# EAGLE design Function-Button-Board (EAGLE 7.1.0)
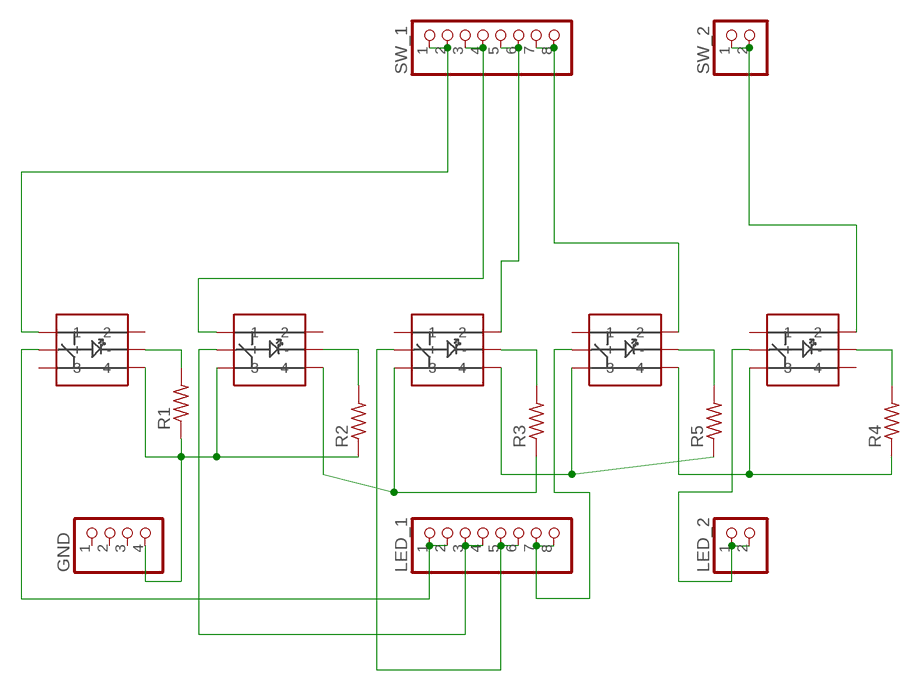
[diagram p0: schematic, sheet 1]

## Parts
FN_1  PB614  [PB614]
FN_2  PB614  [PB614]
FN_3  PB614  [PB614]
FN_4  PB614  [PB614]
FN_5  PB614  [PB614]
GND  PINHD-1X4  [1X04]
LED_1  PINHD-1X8  [1X08]
LED_2  PINHD-1X2  [1X02]
R1  R-US_R1206  [R1206]
R2  R-US_R1206  [R1206]
R3  R-US_R1206  [R1206]
R4  R-US_R1206  [R1206]
R5  R-US_R1206  [R1206]
SW_1  PINHD-1X8  [1X08]
SW_2  PINHD-1X2  [1X02]

## Nets
N$1: FN_1.L+(+) LED_1.1 LED_1.2
N$2: FN_1.L-(-) R1.2
N$3: FN_1.1 SW_1.1 SW_1.2
N$4: FN_3.L+(+) LED_1.5 LED_1.6
N$5: FN_1.4 FN_2.3 GND.4 R1.1 R2.1
N$6: FN_4.L+(+) LED_1.7 LED_1.8
N$7: FN_2.1 SW_1.3 SW_1.4
N$8: FN_2.L+(+) LED_1.3 LED_1.4
N$9: FN_5.L+(+) LED_2.1 LED_2.2
N$10: FN_2.L-(-) R2.2
N$11: FN_3.L-(-) R3.2
N$12: FN_2.4 FN_3.3 R3.1
N$14: FN_4.L-(-) R5.2
N$15: FN_5.L-(-) R4.2
N$16: FN_3.2 SW_1.5 SW_1.6
N$17: FN_3.4 FN_4.3 R5.1
N$18: FN_5.2 SW_2.1 SW_2.2
N$19: FN_4.2 SW_1.7 SW_1.8
N$20: FN_4.4 FN_5.3 R4.1
Unconnected: FN_1.2 FN_1.3 FN_2.2 FN_3.1 FN_4.1 FN_5.1 FN_5.4 GND.1 GND.2 GND.3

## Library data of the parts
FN_1-FN_5 = RSJ-PB614:PB614
GND = pinhead:PINHD-1X4: PIN HEADER
LED_1 SW_1 = pinhead:PINHD-1X8: PIN HEADER
LED_2 SW_2 = pinhead:PINHD-1X2: PIN HEADER
R1-R5 = resistor:R-US_: RESISTOR, American symbol

## Board
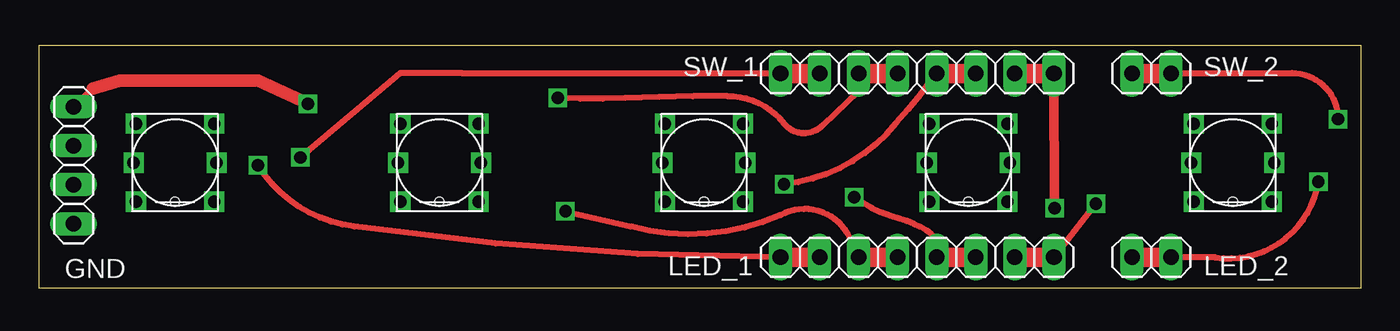
[diagram p1: board, top side]
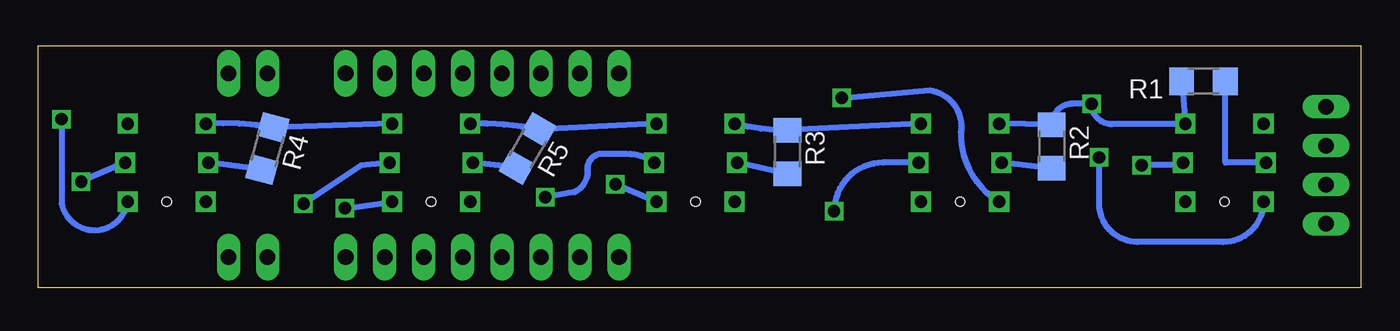
[diagram p2: board, bottom side, seen from below]

Size 86 x 15.77 mm. Coordinates in mm from the lower left corner, seen from the top.
Outline: 0,0 86,0 86,15.77 0,15.77 0,0
Copper layers (1*16): Top 0.035mm / dielectric 1.5mm / Bottom 0.035mm
Design rules "ITEADstudio_DRC": minimum track width 6mil, minimum drill 12mil, track to track 6mil, track to pad 6mil, pad to pad 6mil, via to via 6mil, smd to smd 0mil, copper to edge 10mil, drill to drill 10mil, minimum pad ring 10mil, minimum via ring 6mil, stop-mask expansion 2mil, vias tented up to drill 100mil, thermal gap 10mil

### Footprints (pad centres in the part's own frame; a part is rotated, then mirrored left to right if it is on the bottom)
PB614 = drill 0.8 square: 1 -2.54,2.54; 2 -2.54,-2.54; 3 2.54,2.54; 4 2.54,-2.54; L+ 0,-2.7; L- 0,2.7 | hole 0.6: -2.54,0
1X04 = drill 1.016 long: 1 -3.81,0; 2 -1.27,0; 3 1.27,0; 4 3.81,0
1X08 = drill 1.016 long: 1 -8.89,0; 2 -6.35,0; 3 -3.81,0; 4 -1.27,0; 5 1.27,0; 6 3.81,0; 7 6.35,0; 8 8.89,0
1X02 = drill 1.016 long: 1 -1.27,0; 2 1.27,0
R1206 = smd 1.6 x 1.803: 1 -1.422,0; 2 1.422,0

### Placement (x,y rotation side)
FN_1  8.85,8.16 90 top
FN_2  26.05,8.16 90 top
FN_3  43.25,8.16 90 top
FN_4  60.45,8.16 90 top
FN_5  77.65,8.16 90 top
GND  2.25,8 90 top
LED_1  57.12,2 0 top
LED_2  72.36,2 0 top
R1  10.21,13.46 0 bottom
R2  20.09,9.21 270 bottom
R3  37.28,8.86 270 bottom
R4  71.09,9.08 255 bottom
R5  54.18,9.09 240 bottom
SW_1  57.12,13.97 0 top
SW_2  72.36,13.97 0 top

### Tracks (layer width: path | path; a pad name or v marks a point on that pad's centre or on a via)
N$1  (via drill 0.8)
  Top 0.406: v14.25,8 arc51 20.5,4 arc8 LED_1.1
  Top 1.27: LED_1.2 LED_1.1
  Bottom 0.406: FN_1.L+ arc90 11.71,8 v14.25,8
N$2
  Bottom 0.406: FN_1.L- 8.79,8.16 R1.2
N$3  (via drill 0.8)
  Top 0.406: SW_1.1 27.53,13.97 27.5,14 23.5,14 v17,8.5
  Top 1.27: SW_1.1 SW_1.2
  Bottom 0.406: FN_1.1 arc90 8.93,3 14.5,3 arc90 17,5.5 v17,8.5
N$4  (via drill 0.8)
  Top 0.406: LED_1.5 58.39,2.6 arc59 57.75,3.75 arc16 56,4.5 arc-20 v53.03,5.9
  Top 1.27: LED_1.5 LED_1.6
  Bottom 0.406: v53.03,5.9 51.12,6.25 arc-57 50.25,7.5 arc90 49.5,8.75 47.75,8.75 arc36 FN_3.L+
N$5  (via drill 0.8)
  Top 0.406: GND.4 3.5,13
  Top 0.813: 3.5,13 5.25,13.5 14.25,13.5 v17.5,12
  Bottom 0.406: FN_2.3 R2.1 arc90 18.72,12 v17.5,12 arc-90 16.17,10.67 11.42,10.67 arc-90 FN_1.4 R1.1
N$6  (via drill 0.8)
  Top 0.406: v68.75,5.5 LED_1.8
  Top 1.27: LED_1.7 LED_1.8
  Bottom 0.406: FN_4.L+ 63.34,8.16 65,8 v68.75,5.5
N$7  (via drill 0.8)
  Top 0.406: SW_1.3 53.31,12.81 51,10.62 arc-97 48.48,10.7 arc53 44.75,12.5 arc2 38.12,12.38 arc-6 v33.75,12.38
  Top 1.27: SW_1.3 SW_1.4
  Bottom 0.406: v33.75,12.38 28,12.88 arc90 26,10.13 arc-60 FN_2.1
N$8  (via drill 0.8)
  Top 0.406: 53.25,2.38 LED_1.3 52.75,3.25 arc94 48.25,4.75 arc-39 38.5,4 v34.25,5
  Top 1.27: LED_1.4 LED_1.3
  Bottom 0.406: FN_2.L+ 31.06,8.16 arc-89 v34.25,5
N$9  (via drill 0.8)
  Top 0.406: LED_2.2 76.5,2 arc90 v83.22,6.93
  Top 1.27: LED_2.1 LED_2.2
  Bottom 0.406: FN_5.L+ v83.22,6.93
N$10
  Bottom 0.406: R2.2 FN_2.L-
N$11
  Bottom 0.406: R3.2 FN_3.L-
N$12
  Bottom 0.406: FN_2.4 R3.1 arc16 FN_3.3
N$14
  Bottom 0.406: R5.2 FN_4.L-
N$15
  Bottom 0.406: R4.2 FN_5.L-
N$16  (via drill 0.8)
  Top 0.406: SW_1.5 58,13.5 arc-7 55.75,10.75 arc-45 v48.47,6.76
  Top 0.61: 58.38,13.95 SW_1.5
  Top 1.27: SW_1.5 SW_1.6
  Bottom 0.406: FN_3.2 v48.47,6.76
N$17
  Bottom 0.406: FN_3.4 R5.1 arc-13 FN_4.3
N$18  (via drill 0.8)
  Top 0.406: SW_2.2 arc-90 73.67,14 81.5,14 arc-90 v84.5,11
  Top 1.27: SW_2.1 SW_2.2
  Bottom 0.406: v84.5,11 84.5,5.5 arc-159 FN_5.2
N$19  (via drill 0.8)
  Top 0.61: v66.06,5.19 SW_1.8
  Top 1.27: SW_1.7 SW_1.8
  Bottom 0.406: v66.06,5.19 FN_4.2
N$20
  Bottom 0.406: FN_4.4 R4.1 arc-13 FN_5.3